# Altium project HFA.PrjPcb
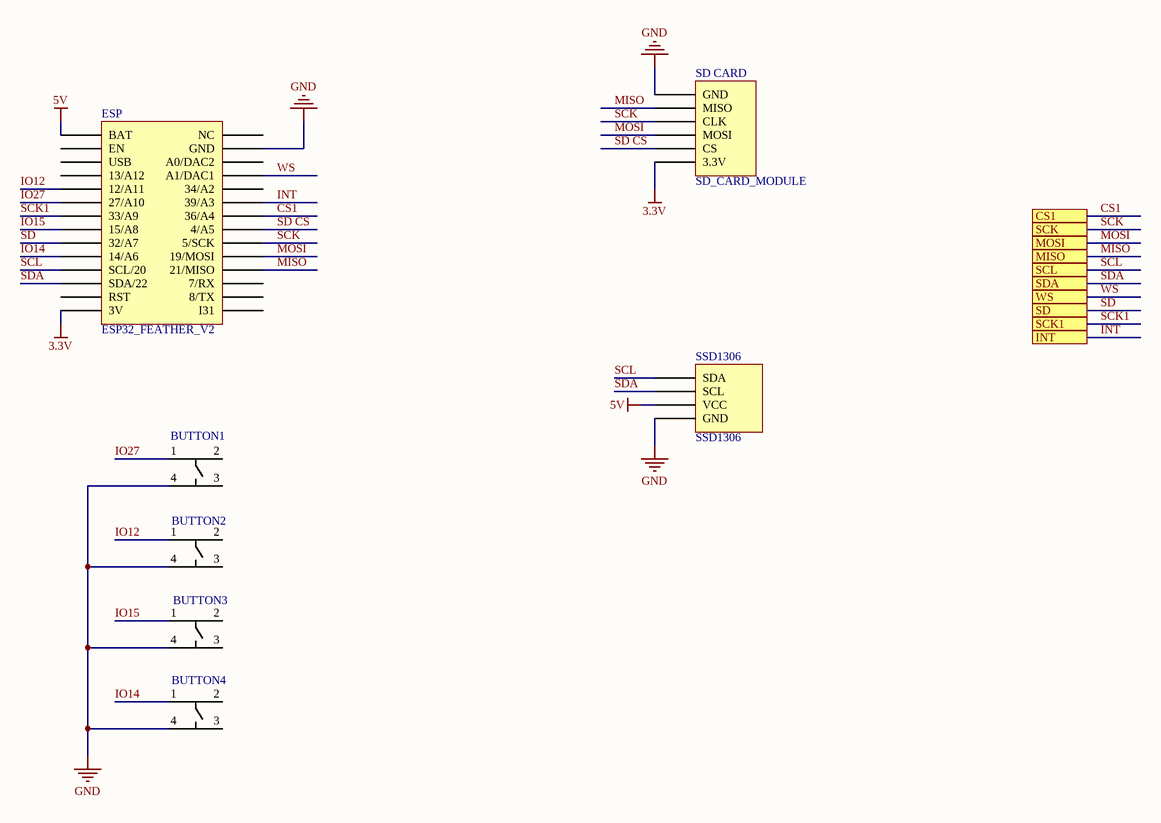
[diagram p0: SCREEN.SchDoc]
3 sheets, 16 parts. Net scope: flat (ports and power ports of the same name join across sheets).
Board file: PCB.PcbDoc
Sheets:
  SCREEN.SchDoc
  SENSOR.SchDoc
  POWER.SchDoc

## Sheet SCREEN.SchDoc
size A4; SheetNumber: 1; SheetTotal: 3

### Parts
BUTTON1  BUTTON  [BUTTON 4PIN]  (value not drawn)
BUTTON2  BUTTON  [BUTTON 4PIN]  (value not drawn)
BUTTON3  BUTTON  [BUTTON 4PIN]  (value not drawn)
BUTTON4  BUTTON  [BUTTON 4PIN]  (value not drawn)
ESP  ESP32_FEATHER_V2  [ESP32_FEATHER_V2]
SD_CARD  SD_CARD_MODULE  [MICRO_SD_CARD_MODULE]
SSD1306  SSD1306  [SSD1306]

### Ports
CS1, INT, MISO, MOSI, SCK, SCK1, SCL, SD, SDA, WS

### Nets
3.3V: ESP.15(3V) SD_CARD.6(3.3V)
5V: ESP.17(BAT) SSD1306.3(VCC)
GND: BUTTON1.4 BUTTON2.4 BUTTON3.4 BUTTON4.4 ESP.13(GND) SD_CARD.1(GND) SSD1306.4(GND)
CS1: ESP.8(36/A4) ; port CS1
INT: ESP.9(39/A3) ; port INT
IO12: BUTTON2.1 ESP.21(12/A11)
IO14: BUTTON4.1 ESP.26(14/A6)
IO15: BUTTON3.1 ESP.24(15/A8)
IO27: BUTTON1.1 ESP.22(27/A10)
MISO: ESP.4(21/MISO) SD_CARD.2(MISO) ; port MISO
MOSI: ESP.5(19/MOSI) SD_CARD.4(MOSI) ; port MOSI
SCK: ESP.6(5/SCK) SD_CARD.3(CLK) ; port SCK
SCK1: ESP.23(33/A9) ; port SCK1
SCL: ESP.27(SCL/20) SSD1306.1(SDA) ; port SCL
SD: ESP.25(32/A7) ; port SD
SD CS: ESP.7(4/A5) SD_CARD.5(CS)
SDA: ESP.28(SDA/22) SSD1306.2(SCL) ; port SDA
WS: ESP.11(A1/DAC1) ; port WS

Not connected (* = marked no-connect by the designer): BUTTON1 2 3; BUTTON2 2 3; BUTTON3 2 3; BUTTON4 2 3; ESP 1(I31) 2(8/TX) 3(7/RX) 10(34/A2) 12(A0/DAC2) 14(NC) 16(RST) 18(EN) 19(USB) 20(13/A12)

### Library data of the parts
BUTTON1-BUTTON4 = BUTTON: 6X6X5mm
ESP = ESP32_FEATHER_V2: ESP32 Feather V2
SSD1306 = SSD1306: 0.96 inch, 128x64

## Sheet SENSOR.SchDoc
size A4; SheetNumber: 2; SheetTotal: 3
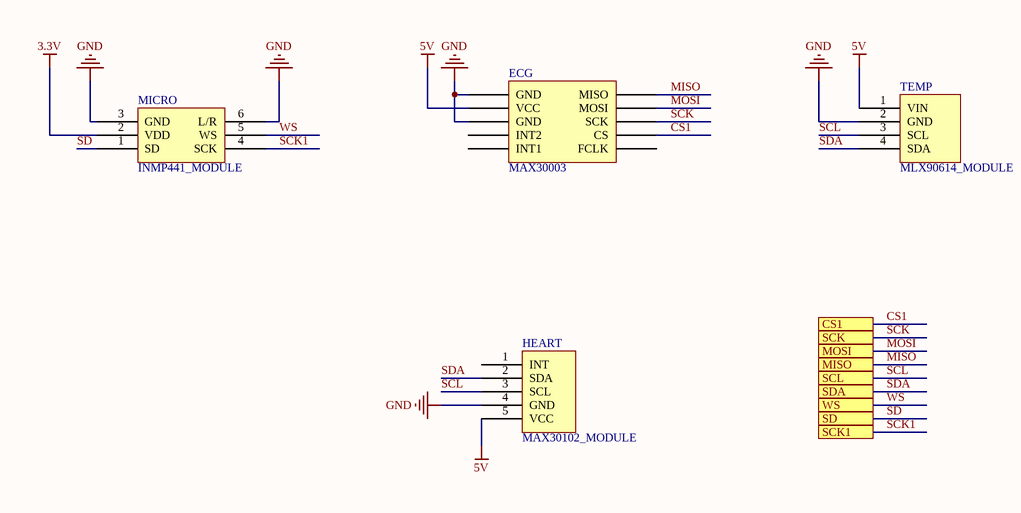
[diagram p1: SENSOR.SchDoc]

### Parts
ECG  MAX30003  [MAX30003]
HEART  MAX30102_MODULE  [MAX30102_module]
MICRO  INMP441_MODULE  [INMP441_MODULE]
TEMP  MLX90614_MODULE  [MLX90614_MODULE]

### Ports
CS1, MISO, MOSI, SCK, SCK1, SCL, SD, SDA, WS

### Nets
3.3V: MICRO.2(VDD)
5V: ECG.VCC HEART.5(VCC) TEMP.1(VIN)
GND: ECG.GND HEART.4(GND) MICRO.3(GND) MICRO.6(L/R) TEMP.2(GND)
CS1: ECG.CS ; port CS1
MISO: ECG.MISO ; port MISO
MOSI: ECG.MOSI ; port MOSI
SCK: ECG.SCK ; port SCK
SCK1: MICRO.4(SCK) ; port SCK1
SCL: HEART.3(SCL) TEMP.3(SCL) ; port SCL
SD: MICRO.1(SD) ; port SD
SDA: HEART.2(SDA) TEMP.4(SDA) ; port SDA
WS: MICRO.5(WS) ; port WS

Not connected (* = marked no-connect by the designer): ECG FCLK INT1 INT2; HEART 1(INT)

## Sheet POWER.SchDoc
size A4; SheetNumber: 3; SheetTotal: 3
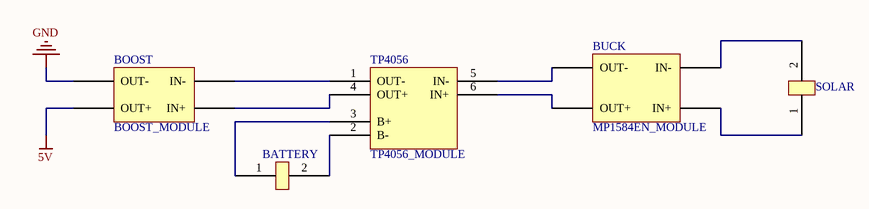
[diagram p2: POWER.SchDoc]

### Parts
BATTERY  PAD_SW  [PAD_SW]  (value not drawn)
BOOST  BOOST_MODULE  [BOOST_MODULE_MINI]
BUCK  MP1584EN_MODULE  [MP1584EN_MODULE]
SOLAR  SOLAR  [PAD_SW]  (value not drawn)
TP4056  TP4056_MODULE  [TP4056_MODULE]

### Nets
5V: BOOST.3(OUT+)
GND: BOOST.4(OUT-)
NetBATTERY_1: BATTERY.1(SW1) TP4056.3(B+)
NetBATTERY_2: BATTERY.2(SW2) TP4056.2(B-)
NetBOOST_1: BOOST.1(IN+) TP4056.4(OUT+)
NetBOOST_2: BOOST.2(IN-) TP4056.1(OUT-)
NetBUCK_1: BUCK.1(IN+) SOLAR.1(SW1)
NetBUCK_2: BUCK.2(IN-) SOLAR.2(SW2)
NetBUCK_3: BUCK.3(OUT+) TP4056.6(IN+)
NetBUCK_4: BUCK.4(OUT-) TP4056.5(IN-)

### Library data of the parts
SOLAR = PAD_SW

## Nets that join several sheets
3.3V: SCREEN (ESP.15 SD_CARD.6), SENSOR (MICRO.2)
5V: SCREEN (ESP.17 SSD1306.3), SENSOR (ECG.VCC HEART.5 TEMP.1), POWER (BOOST.3)
GND: SCREEN (7 pins), SENSOR (5 pins), POWER (BOOST.4)
CS1: SCREEN (ESP.8), SENSOR (ECG.CS)
MISO: SCREEN (ESP.4 SD_CARD.2), SENSOR (ECG.MISO)
MOSI: SCREEN (ESP.5 SD_CARD.4), SENSOR (ECG.MOSI)
SCK: SCREEN (ESP.6 SD_CARD.3), SENSOR (ECG.SCK)
SCK1: SCREEN (ESP.23), SENSOR (MICRO.4)
SCL: SCREEN (ESP.27 SSD1306.1), SENSOR (HEART.3 TEMP.3)
SD: SCREEN (ESP.25), SENSOR (MICRO.1)
SDA: SCREEN (ESP.28 SSD1306.2), SENSOR (HEART.2 TEMP.4)
WS: SCREEN (ESP.11), SENSOR (MICRO.5)